# EAGLE design YurtLightsOfLove (EAGLE 7.3.0)
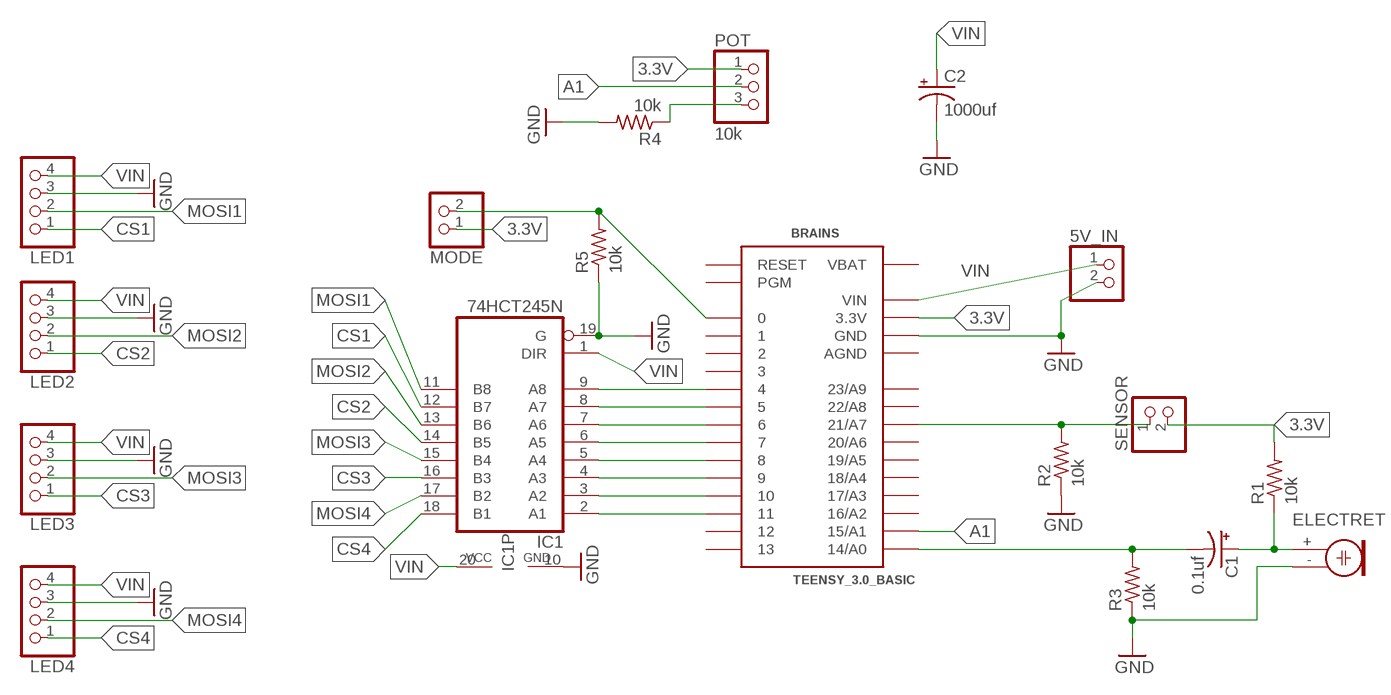
[diagram p0: schematic, sheet 1]

## Parts
5V_IN  PINHD-1X2  [1X02]
BRAINS  TEENSY_3.0_BASIC  [TEENSY_3.0_BASIC]
C1  0.1uf  CPOL-USE5-5  [E5-5]
C2  1000uf  CPOL-USE3.5-8  [E3,5-8]
ELECTRET  ELECTRET  [9.7ELECTRET]
IC1  74HCT245N  [DIL20]
LED1  PINHD-1X4  [1X04]
LED2  PINHD-1X4  [1X04]
LED3  PINHD-1X4  [1X04]
LED4  PINHD-1X4  [1X04]
MODE  PINHD-1X2  [1X02]
POT  10k  PINHD-1X3  [1X03]
R1  10k  R-US_0207/10  [0207/10]
R2  10k  R-US_0207/10  [0207/10]
R3  10k  R-US_0207/10  [0207/10]
R4  10k  R-US_0207/10  [0207/10]
R5  10k  R-US_0207/10  [0207/10]
SENSOR  PINHD-1X2  [1X02]

## Nets
3.3V: BRAINS.3.3V BRAINS.3.3V1(3.3V) MODE.1 POT.1 R1.2 SENSOR.2
A1: BRAINS.15/A1 POT.2
CS1: IC1.12(B7) LED1.1
CS2: IC1.14(B5) LED2.1
CS3: IC1.16(B3) LED3.1
CS4: IC1.18(B1) LED4.1
GND: 5V_IN.2 BRAINS.GND BRAINS.GND1(GND) C2.- ELECTRET.- IC1.10(GND) IC1.19(G) LED1.3 LED2.3 LED3.3 LED4.3 R2.1 R3.1 R4.2 R5.1
MOSI1: IC1.11(B8) LED1.2
MOSI2: IC1.13(B6) LED2.2
MOSI3: IC1.15(B4) LED3.2
MOSI4: IC1.17(B2) LED4.2
N$1: BRAINS.4 IC1.9(A8)
N$2: BRAINS.5 IC1.8(A7)
N$3: BRAINS.6 IC1.7(A6)
N$4: BRAINS.7 IC1.6(A5)
N$5: BRAINS.8 IC1.5(A4)
N$6: BRAINS.9 IC1.4(A3)
N$7: BRAINS.10 IC1.3(A2)
N$8: BRAINS.11 IC1.2(A1)
N$10: C1.+ ELECTRET.+ R1.1
N$18: POT.3 R4.1
N$20: BRAINS.14/A0 C1.- R3.2
N$21: BRAINS.0 MODE.2 R5.2
N$23: BRAINS.21/A7 R2.2 SENSOR.1
VIN: 5V_IN.1 BRAINS.VIN C2.+ IC1.1(DIR) IC1.20(VCC) LED1.4 LED2.4 LED3.4 LED4.4
Unconnected: BRAINS.1 BRAINS.2 BRAINS.3 BRAINS.12 BRAINS.13 BRAINS.16/A2 BRAINS.17/A3 BRAINS.18/A4 BRAINS.19/A5 BRAINS.20/A6 BRAINS.22/A8 BRAINS.23/A9 BRAINS.PGM BRAINS.RESET

## Power pins joined to a net without a drawn wire
AGND: BRAINS.AGND
VBAT: BRAINS.VBAT

## Library data of the parts
5V_IN MODE SENSOR = pinhead:PINHD-1X2: PIN HEADER; ADAFRUITPART: .1" screw terminal block; OC_NEWARK: unknown
BRAINS = Teensy3.0:TEENSY_3.0_BASIC: Basic Teensy 3.0 with none of the 'inner' pins enabled. See '+4', 'AllAnalogPins", and 'AllPins' packages for additional pin holes, as needed.; OC_NEWARK: unknown
C1 C2 = rcl:CPOL-US: POLARIZED CAPACITOR, American symbol; OC_NEWARK: unknown
ELECTRET = adafruit:ELECTRET: Electret microphone Thru hole 2.54mm spacing with 9.7mm diameter; OC_NEWARK: unknown
IC1 = 74xx-eu:74*245: Octal BUS TRANSCEIVER, 3-state; OC_NEWARK: unknown
LED1-LED4 = pinhead:PINHD-1X4: PIN HEADER; OC_NEWARK: unknown
POT = adafruit:PINHD-1X3: PIN HEADER; ADAFRUITPART: .1" screw terminal block; OC_NEWARK: unknown
R1-R5 = adafruit:R-US_: RESISTOR, American symbol; OC_NEWARK: unknown

## Board
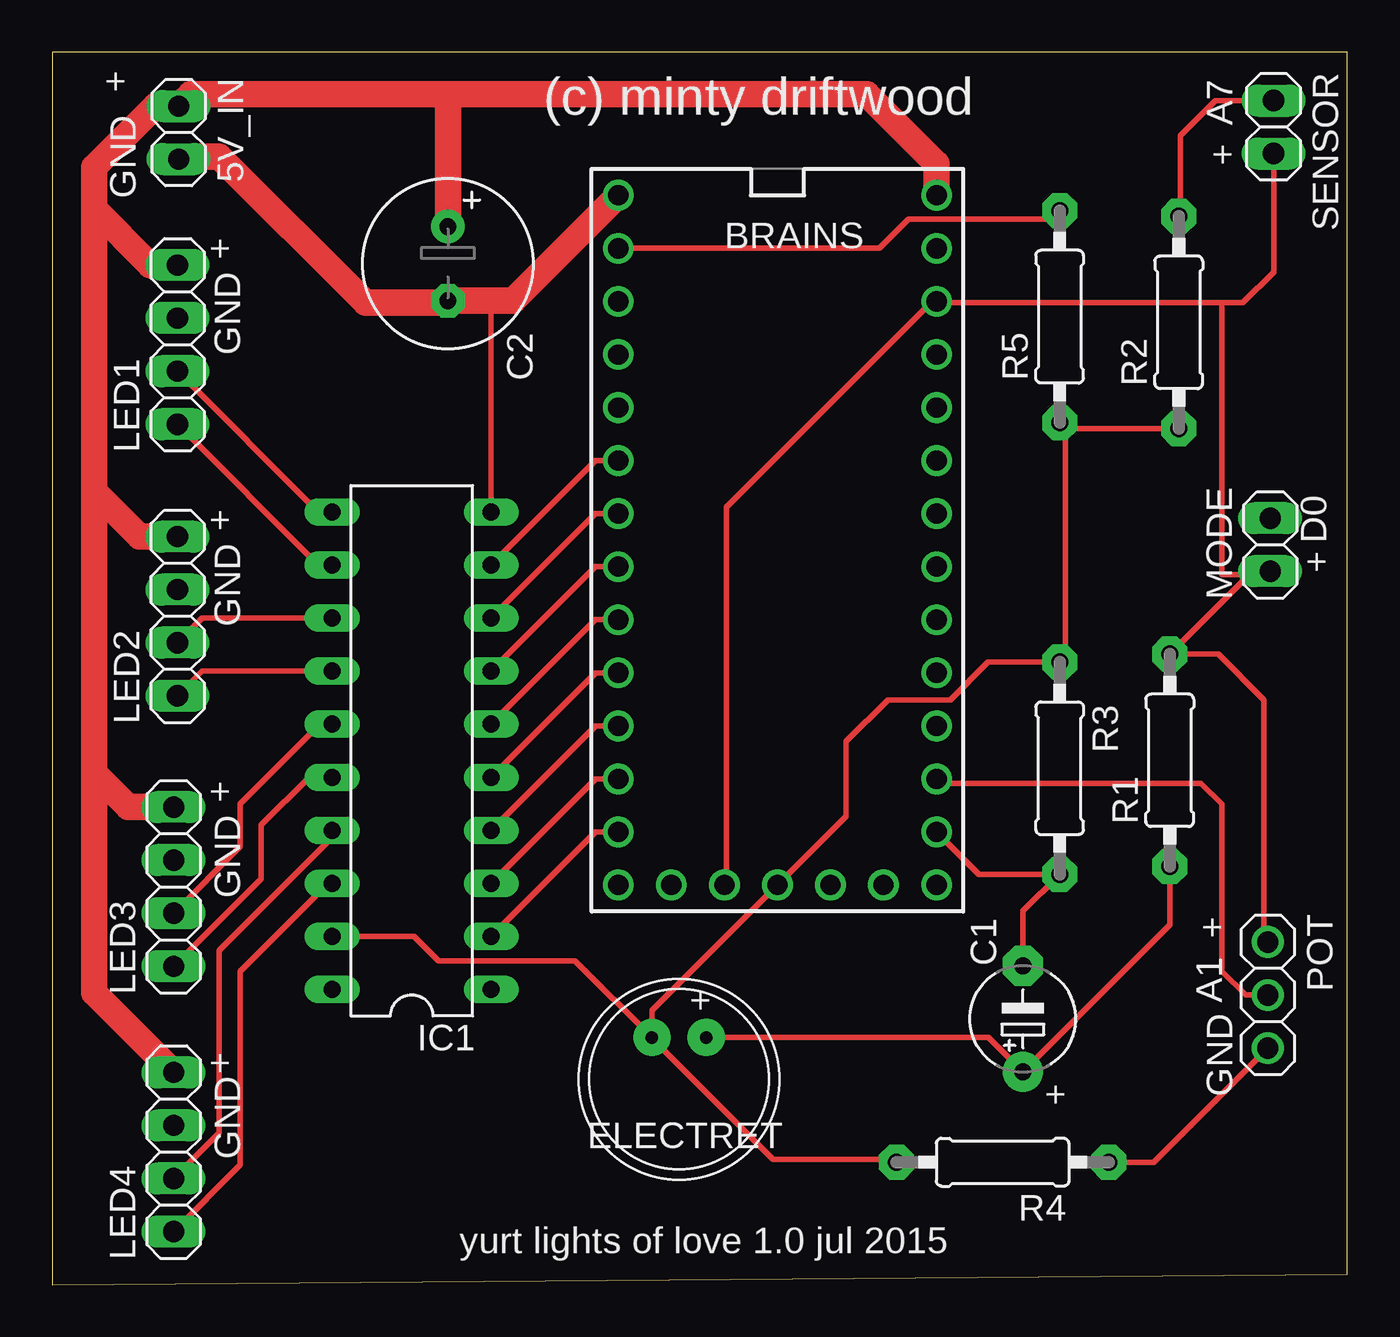
[diagram p1: board, top side]
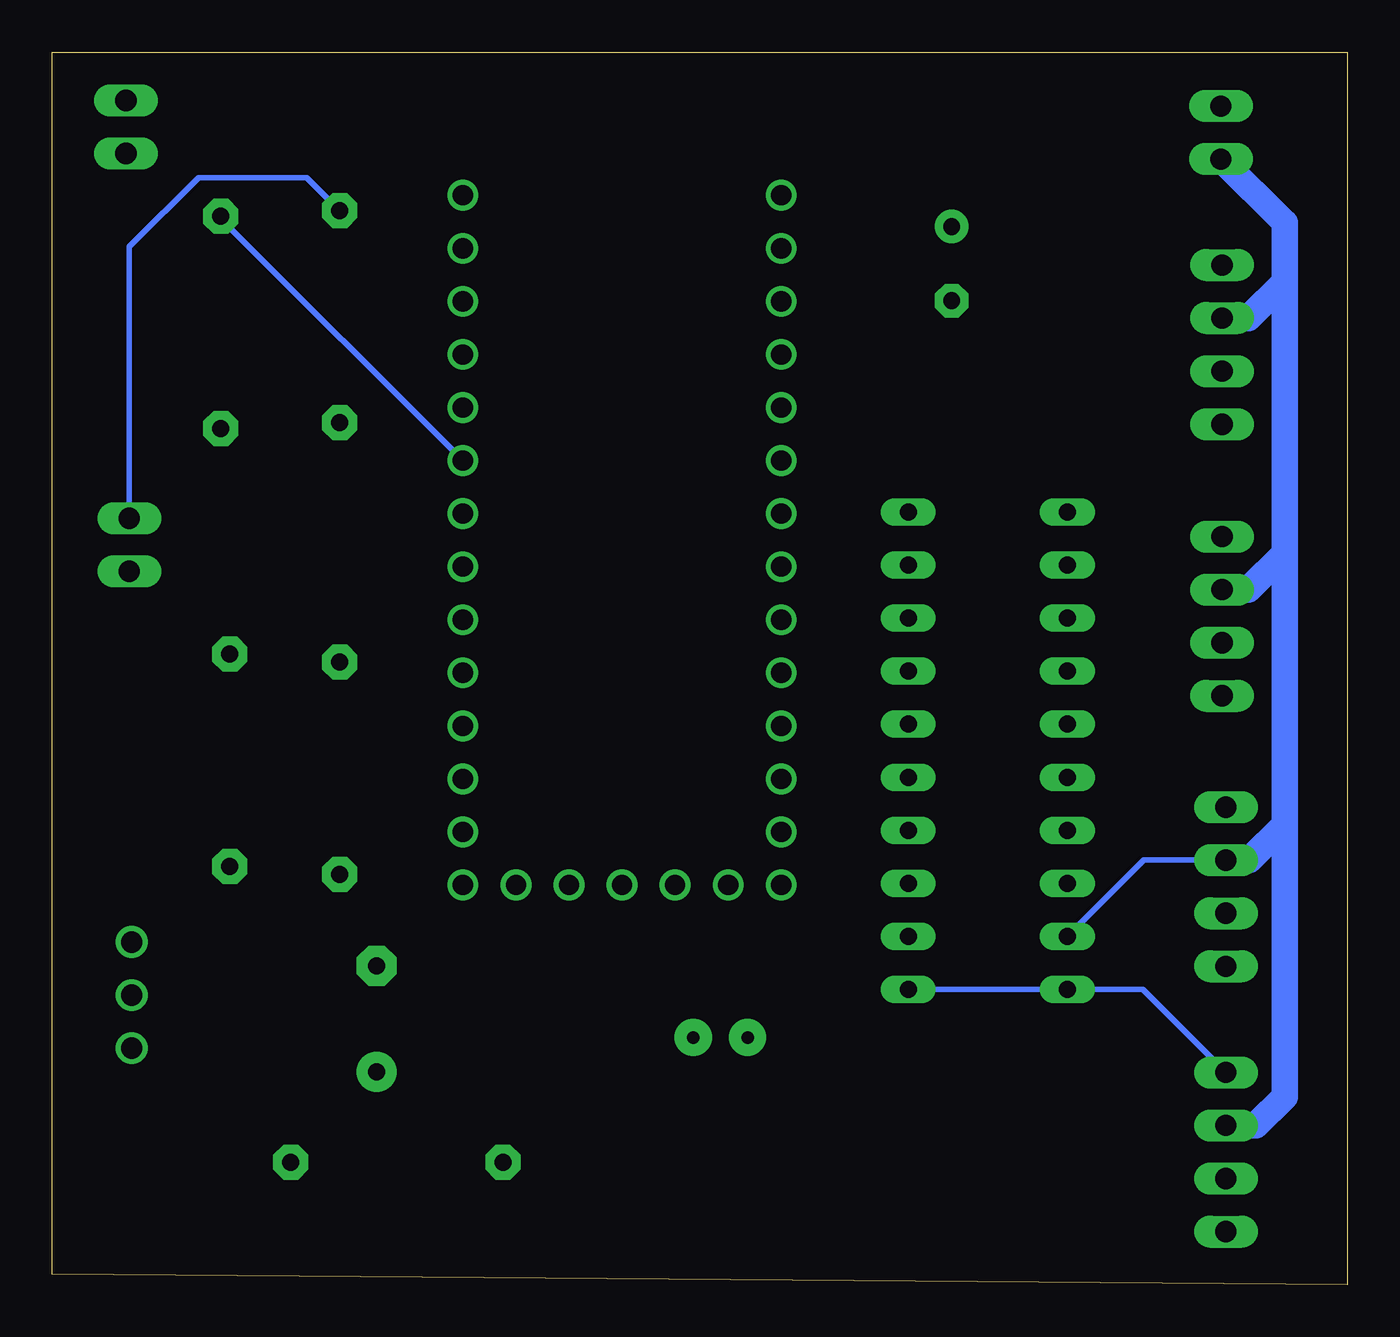
[diagram p2: board, bottom side, seen from below]

Size 62 x 59 mm. Coordinates in mm from the lower left corner, seen from the top.
Outline: 0,0 62,0.5 62,59 0,59 0,0
Copper layers (1*16): Top 0.035mm / dielectric 1.5mm / Bottom 0.035mm
Design rules "default": minimum track width 10mil, minimum drill 24mil, track to track 8mil, track to pad 8mil, pad to pad 8mil, via to via 8mil, smd to smd 8mil, copper to edge 40mil, drill to drill 8mil, minimum pad ring 10mil, minimum via ring 8mil, stop-mask expansion 4mil, vias tented up to drill 0mil, thermal gap 10mil

### Footprints (pad centres in the part's own frame; a part is rotated, then mirrored left to right if it is on the bottom)
1X02 = drill 1.016 long: 1 -1.27,0; 2 1.27,0
TEENSY_3.0_BASIC = drill 0.965: 0 -7.62,13.97; 1 -7.62,11.43; 2 -7.62,8.89; 3 -7.62,6.35; 3.3V 7.62,11.43; 3.3V1 -2.54,-16.51; 4 -7.62,3.81; 5 -7.62,1.27; 6 -7.62,-1.27; 7 -7.62,-3.81; 8 -7.62,-6.35; 9 -7.62,-8.89; 10 -7.62,-11.43; 11 -7.62,-13.97; 12 -7.62,-16.51; 13 7.62,-16.51; 14/A0 7.62,-13.97; 15/A1 7.62,-11.43; 16/A2 7.62,-8.89; 17/A3 7.62,-6.35; 18/A4 7.62,-3.81; 19/A5 7.62,-1.27; 20/A6 7.62,1.27; 21/A7 7.62,3.81; 22/A8 7.62,6.35; 23/A9 7.62,8.89; AGND 7.62,13.97; GND -7.62,16.51; GND1 0,-16.51; PGM 2.54,-16.51; RESET 5.08,-16.51; VBAT -5.08,-16.51; VIN 7.62,16.51
E5-5 = drill 0.813 pad 1.905: + -2.54,0 | drill 0.813 pad 1.905 octagon: - 2.54,0
E3,5-8 = drill 0.813 pad 1.6: + -1.778,0 | drill 0.813 pad 1.6 octagon: - 1.778,0
9.7ELECTRET = drill 0.6 pad 1.778: + 1.3,2; - -1.3,2
DIL20 = drill 0.813 long: 1 -11.43,-3.81; 2 -8.89,-3.81; 3 -6.35,-3.81; 4 -3.81,-3.81; 5 -1.27,-3.81; 6 1.27,-3.81; 7 3.81,-3.81; 8 6.35,-3.81; 9 8.89,-3.81; 10 11.43,-3.81; 11 11.43,3.81; 12 8.89,3.81; 13 6.35,3.81; 14 3.81,3.81; 15 1.27,3.81; 16 -1.27,3.81; 17 -3.81,3.81; 18 -6.35,3.81; 19 -8.89,3.81; 20 -11.43,3.81
1X04 = drill 1.016 long: 1 -3.81,0; 2 -1.27,0; 3 1.27,0; 4 3.81,0
1X03 = drill 1.016: 1 -2.54,0; 2 0,0; 3 2.54,0
0207/10 = drill 0.813 pad 1.676 octagon: 1 -5.08,0; 2 5.08,0

### Placement (x,y rotation side)
5V_IN  6.05,55.15 270 top
BRAINS  34.72,35.64 0 top
C1  46.47,12.72 90 top
C2  18.94,48.88 270 top
ELECTRET  30.01,9.83 0 top
IC1  17.21,25.56 90 top
LED1  6,45 90 top
LED2  6,32 90 top
LED3  5.81,19.05 90 top
LED4  5.81,6.35 90 top
MODE  58.31,35.42 90 top
POT  58.2,13.86 270 top
R1  53.5,25.1 90 top
R2  53.93,46.07 90 top
R3  48.23,24.72 270 top
R4  45.5,5.86 180 top
R5  48.23,46.34 90 top
SENSOR  58.47,55.42 270 top

### Tracks (layer width: path | path; a pad name or v marks a point on that pad's centre or on a via)
3.3V
  Top 0.254: BRAINS.3.3V1 32.29,19.17 32.29,37.23 42.12,47.06 BRAINS.3.3V 42.41,47 56,47 | SENSOR.2 58.47,48.47 57,47 56,47 | 56,47 56,34 57,34 57.15,34.15 MODE.1 57.47,34.15 R1.2 55.82,30.18 58,28 58,16.6 POT.1
A1
  Top 0.254: POT.2 57.14,13.86 56,15 56,23 55,24 42.55,24 BRAINS.15/A1
CS1
  Top 0.254: IC1.12 12.74,34.45 LED1.1
CS2
  Top 0.254: IC1.14 7.18,29.37 LED2.1
CS3
  Top 0.254: IC1.16 12.29,24.29 10,22 10,19.43 LED3.1
CS4
  Top 0.254: IC1.18 13.21,19.21 9,15 9,5.73 LED4.1
GND
  Top 0.254: IC1.10 21.02,47.08 21,47.1 | R2.1 48.5,40.99 | 48.5,40.99 R5.1 | 48.5,40.99 48.5,30.07 R3.1 44.8,29.8 43,28 40,28 38,26 38,22.41 BRAINS.GND1 28.71,13.12 ELECTRET.- | IC1.19 17.33,16.67 18.5,15.5 25.04,15.5 ELECTRET.- | ELECTRET.- 28.71,11.79 34.5,6 40.28,6 R4.2
  Top 1.27: BRAINS.GND 22.05,47.1 21,47.1 C2.- 18.84,47 15,47 8,54 6,54 6.05,53.95 5V_IN.2
  Bottom 0.254: LED3.3 9.75,20.32 IC1.19
  Bottom 1.27: LED4.3 4.38,7.62 3,9 3,22 | 3,22 3,35 | 3,35 3,48 | 3,48 3,50.83 5V_IN.2 | LED3.3 4.68,20.32 3,22 | LED2.3 4.73,33.27 3,35 | LED1.3 4.73,46.27 3,48
MOSI1
  Top 0.254: IC1.11 12.74,36.99 LED1.2
MOSI2
  Top 0.254: IC1.13 7.18,31.91 LED2.2
MOSI3
  Top 0.254: IC1.15 12.83,26.83 9,23 9,20.97 LED3.2
MOSI4
  Top 0.254: IC1.17 13.4,21.4 8,16 8,7.27 LED4.2
N$1
  Top 0.254: BRAINS.4 26.02,39.45 IC1.9
N$2
  Top 0.254: BRAINS.5 26.02,36.91 IC1.8
N$3
  Top 0.254: BRAINS.6 26.02,34.37 IC1.7
N$4
  Top 0.254: BRAINS.7 26.02,31.83 IC1.6
N$5
  Top 0.254: BRAINS.8 26.02,29.29 IC1.5
N$6
  Top 0.254: BRAINS.9 26.02,26.75 IC1.4
N$7
  Top 0.254: BRAINS.10 26.02,24.21 IC1.3
N$8
  Top 0.254: BRAINS.11 26.02,21.67 IC1.2
N$10
  Top 0.254: ELECTRET.+ 44.82,11.83 C1.+ 53.5,17.21 R1.1
N$18
  Top 0.254: R4.1 52.74,5.86 POT.3
N$20
  Top 0.254: C1.- 46.47,17.88 R3.2 44.37,19.64 BRAINS.14/A0
N$21
  Top 0.254: BRAINS.0 39.61,49.61 41,51 47.81,51 R5.2
  Bottom 0.254: MODE.2 58.31,49.69 55,53 49.81,53 R5.2
N$23
  Top 0.254: SENSOR.1 55.69,56.69 54,55 54,51.22 R2.2
  Bottom 0.254: R2.2 53.93,51.04 BRAINS.21/A7
VIN
  Top 1.27: BRAINS.VIN 42.34,53.66 39,57 19,57 | 19,57 6.63,57 5V_IN.1 4.92,56.42 2,53.5 2,51.5 | C2.+ 18.94,56.94 19,57 | 2,51.5 2,38 | 2,38 2,24.5 | 2,24.5 2,13.97 LED4.4 | LED3.4 3.64,22.86 2,24.5 | LED2.4 4.19,35.81 2,38 | LED1.4 4.69,48.81 2,51.5
  Bottom 0.254: IC1.1 IC1.20 9.78,14.13 LED4.4

### Text on the board
tNames: + | (c) minty driftwood | A7 | + | GND | + | GND | + | D0 | + | GND | + | GND | + | A1 | + | + | GND | + | GND | yurt lights of love 1.0 jul 2015